# EAGLE schematic backplane (EAGLE 6.4)
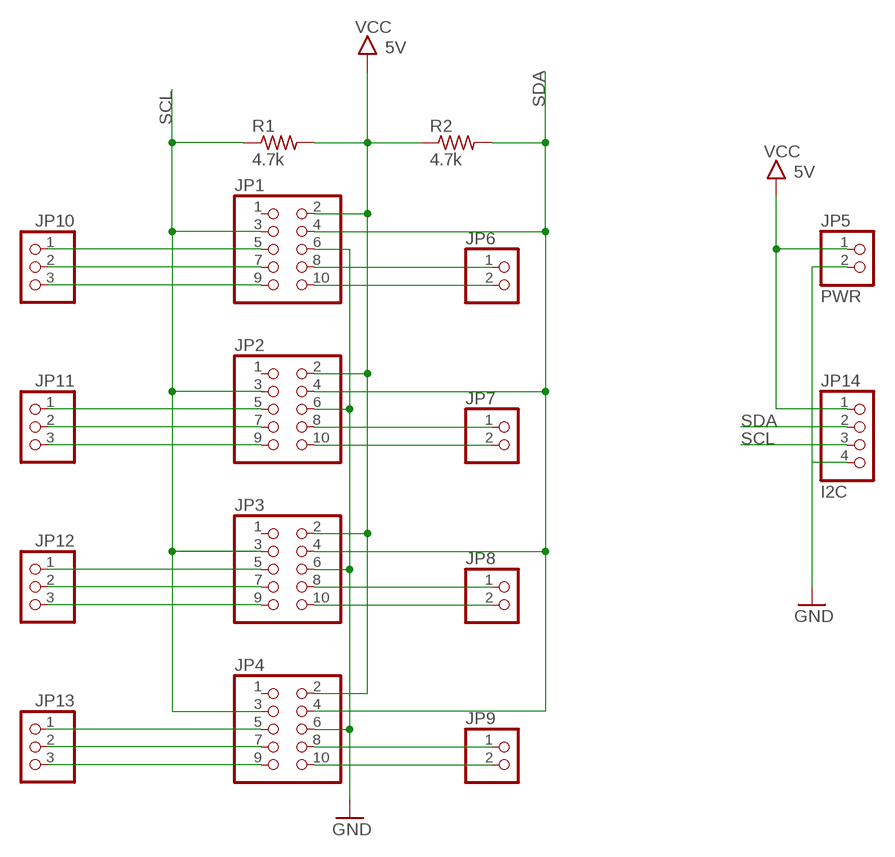
[diagram p0: schematic, sheet 1]

## Parts
JP1  PINHD-2X5  [2X05]
JP2  PINHD-2X5  [2X05]
JP3  PINHD-2X5  [2X05]
JP4  PINHD-2X5  [2X05]
JP5  PWR  PINHD-1X02_2.54-S  [1X02-S]
JP6  PINHD-1X02_2.54-S  [1X02-S]
JP7  PINHD-1X02_2.54-S  [1X02-S]
JP8  PINHD-1X02_2.54-S  [1X02-S]
JP9  PINHD-1X02_2.54-S  [1X02-S]
JP10  PINHD-1X03_2.54-S  [1X03-S]
JP11  PINHD-1X03_2.54-S  [1X03-S]
JP12  PINHD-1X03_2.54-S  [1X03-S]
JP13  PINHD-1X03_2.54-S  [1X03-S]
JP14  I2C  PINHD-1X04_2.54-S  [1X04-S]
R1  4.7k  R-US_R0603  [R0603]
R2  4.7k  R-US_R0603  [R0603]

## Nets
GND: JP1.6 JP2.6 JP3.6 JP4.6 JP5.2 JP14.4
N$1: JP1.5 JP10.1
N$2: JP1.7 JP10.2
N$3: JP1.9 JP10.3
N$4: JP1.8 JP6.1
N$5: JP2.5 JP11.1
N$6: JP2.7 JP11.2
N$7: JP2.9 JP11.3
N$8: JP3.5 JP12.1
N$9: JP3.7 JP12.2
N$10: JP3.9 JP12.3
N$11: JP4.5 JP13.1
N$12: JP4.7 JP13.2
N$13: JP4.9 JP13.3
N$14: JP1.10 JP6.2
N$15: JP2.8 JP7.1
N$16: JP2.10 JP7.2
N$17: JP3.8 JP8.1
N$18: JP3.10 JP8.2
N$19: JP4.8 JP9.1
N$20: JP4.10 JP9.2
SCL: JP1.3 JP2.3 JP3.3 JP4.3 JP14.3 R1.1
SDA: JP1.4 JP2.4 JP3.4 JP4.4 JP14.2 R2.2
VCC: JP1.2 JP2.2 JP3.2 JP4.2 JP5.1 JP14.1 R1.2 R2.1 ; supply symbol labelled 5V
Unconnected: JP1.1 JP2.1 JP3.1 JP4.1

## Library data of the parts
JP1-JP4 = pinhead:PINHD-2X5: PIN HEADER
JP5-JP9 = pinhead-2:PINHD-1X02: PIN HEADER
JP10-JP13 = pinhead-2:PINHD-1X03: PIN HEADER
JP14 = pinhead-2:PINHD-1X04: PIN HEADER
R1 R2 = rcl:R-US_: RESISTOR, American symbol